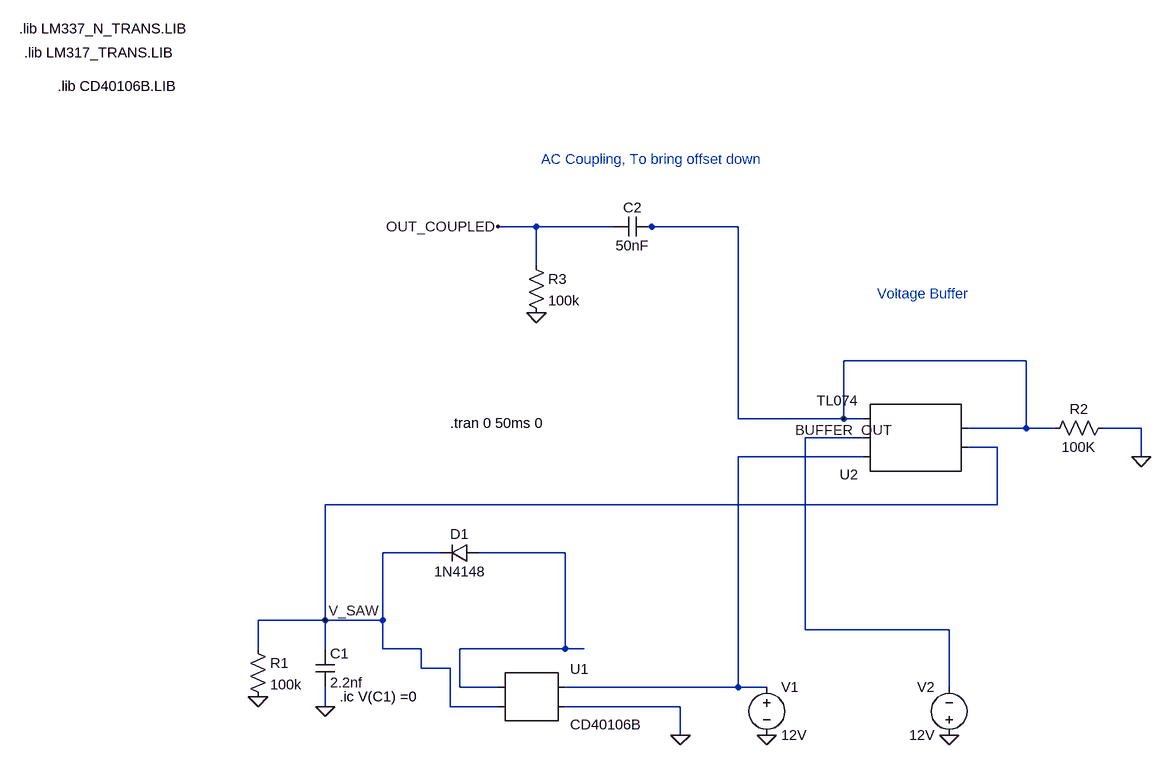
[diagram p0: schematic Draft1.asc]
Draft1.asc, the LTspice schematic file:
Version 4
SHEET 1 3956 1680
WIRE 2928 800 2864 800
WIRE 3056 800 2928 800
WIRE 3120 800 3104 800
WIRE 3264 800 3120 800
WIRE 2928 864 2928 800
WIRE 3744 1024 3440 1024
WIRE 3264 1120 3264 800
WIRE 3440 1120 3440 1024
WIRE 3440 1120 3264 1120
WIRE 3472 1120 3440 1120
WIRE 3744 1136 3744 1024
WIRE 3744 1136 3648 1136
WIRE 3792 1136 3744 1136
WIRE 3936 1136 3872 1136
WIRE 3472 1152 3376 1152
WIRE 3696 1168 3648 1168
WIRE 3472 1184 3264 1184
WIRE 3936 1184 3936 1136
WIRE 3696 1264 3696 1168
WIRE 3696 1264 2576 1264
WIRE 2768 1344 2672 1344
WIRE 2976 1344 2832 1344
WIRE 2576 1456 2576 1264
WIRE 2576 1456 2464 1456
WIRE 2672 1456 2672 1344
WIRE 2672 1456 2576 1456
WIRE 3376 1472 3376 1152
WIRE 3616 1472 3376 1472
WIRE 2464 1504 2464 1456
WIRE 2576 1504 2576 1456
WIRE 2672 1504 2672 1456
WIRE 2736 1504 2672 1504
WIRE 2976 1504 2976 1344
WIRE 2976 1504 2800 1504
WIRE 3008 1504 2976 1504
WIRE 2736 1536 2736 1504
WIRE 2784 1536 2736 1536
WIRE 2800 1568 2800 1504
WIRE 2864 1568 2800 1568
WIRE 3264 1568 3264 1184
WIRE 3264 1568 2976 1568
WIRE 3312 1568 3264 1568
WIRE 3616 1568 3616 1472
WIRE 2576 1600 2576 1568
WIRE 2784 1600 2784 1536
WIRE 2864 1600 2784 1600
WIRE 3168 1600 2976 1600
WIRE 3168 1648 3168 1600
FLAG 2576 1600 0
FLAG 2464 1584 0
FLAG 3168 1648 0
FLAG 3312 1648 0
FLAG 3616 1648 0
FLAG 2576 1456 V_SAW
FLAG 3936 1184 0
FLAG 2928 944 0
FLAG 2864 800 OUT_COUPLED
FLAG 3440 1120 BUFFER_OUT
SYMBOL cap 2560 1504 R0
SYMATTR InstName C1
SYMATTR Value 2.2nf
SYMBOL res 2448 1488 R0
SYMATTR InstName R1
SYMATTR Value 100k
SYMBOL voltage 3312 1552 R0
SYMATTR InstName V1
SYMATTR Value 12V
SYMBOL AutoGenerated\\CD40106B 2912 1584 R0
SYMATTR InstName U1
SYMBOL diode 2832 1328 R90
WINDOW 0 0 32 VBottom 2
WINDOW 3 32 32 VTop 2
SYMATTR InstName D1
SYMATTR Value 1N4148
SYMBOL AutoGenerated\\TL074 3504 1152 R180
SYMATTR InstName U2
SYMBOL voltage 3616 1664 R180
WINDOW 0 24 96 Left 2
WINDOW 3 24 16 Left 2
SYMATTR InstName V2
SYMATTR Value 12V
SYMBOL res 3888 1120 R90
WINDOW 0 0 56 VBottom 2
WINDOW 3 32 56 VTop 2
SYMATTR InstName R2
SYMATTR Value 100K
SYMBOL cap 3120 784 R90
WINDOW 0 0 32 VBottom 2
WINDOW 3 32 32 VTop 2
SYMATTR InstName C2
SYMATTR Value 50nF
SYMBOL res 2912 848 R0
SYMATTR InstName R3
SYMATTR Value 100k
TEXT -744 280 Left 2 !.lib LM337_N_TRANS.LIB
TEXT -736 320 Left 2 !.lib LM317_TRANS.LIB
TEXT -680 376 Left 2 !.lib CD40106B.LIB
TEXT 2784 1128 Left 2 !.tran 0 50ms 0
TEXT 2600 1584 Left 2 !.ic V(C1) =0
TEXT 3496 912 Left 2 ;Voltage Buffer
TEXT 2936 688 Left 2 ;AC Coupling, To bring offset down

The netlist it stands for:
* Draft1.asc
C1 V_SAW 0 2.2nf
R1 V_SAW 0 100k
V1 N002 0 12V
* U1: CD40106B (symbol AutoGenerated\CD40106B not available, pins judged from their places): pin1=N003 pin2=V_SAW pin3=N002 pin4=0
D1 N003 V_SAW 1N4148
* U2: TL074 (symbol AutoGenerated\TL074 not available, pins judged from their places): pin1=V_SAW pin2=BUFFER_OUT pin3=N002 pin4=N001 pin5=BUFFER_OUT
V2 0 N001 12V
R2 0 BUFFER_OUT 100K
C2 BUFFER_OUT OUT_COUPLED 50nF
R3 OUT_COUPLED 0 100k
.model D D
.lib standard.dio
.lib LM337_N_TRANS.LIB
.lib LM317_TRANS.LIB
.lib CD40106B.LIB
.tran 0 50ms 0
.ic V(C1) =0
* Voltage Buffer
* AC Coupling, To bring offset down
.backanno
.end